# Altium project UHF_Deployment.PrjPcb
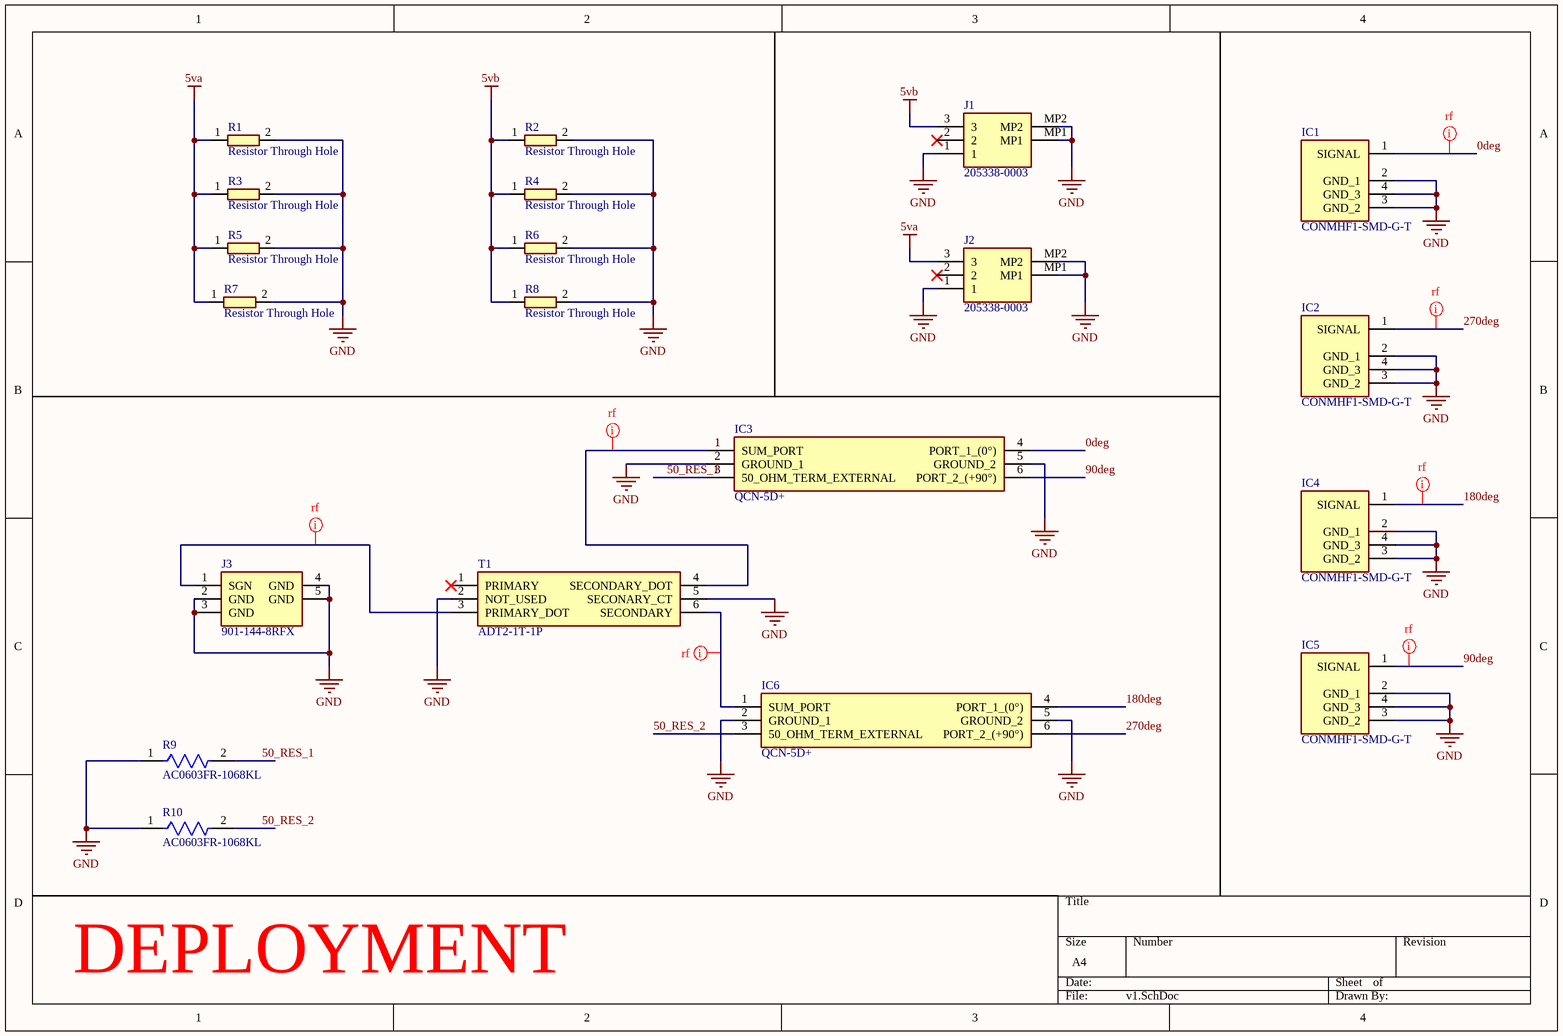
[diagram p0: v1.SchDoc]
1 sheet, 20 parts. Net scope: global (net labels, ports and power ports of the same name join across sheets).
Board file: PCB1.PcbDoc

## Sheet v1.SchDoc
size A4; SheetNumber: 1; SheetTotal: 1

### Parts
IC1  CONMHF1-SMD-G-T  [CONMHF1SMDGT]
IC2  CONMHF1-SMD-G-T  [CONMHF1SMDGT]
IC3  QCN-5D+  [QCN5D]
IC4  CONMHF1-SMD-G-T  [CONMHF1SMDGT]
IC5  CONMHF1-SMD-G-T  [CONMHF1SMDGT]
IC6  QCN-5D+  [QCN5D]
J1  205338-0003  [2053380003]
J2  205338-0003  [2053380003]
J3  901-144-8RFX  [9011448RFX]
R1  Resistor Through Hole  [ResistoR THROUGHHOLE]
R2  Resistor Through Hole  [ResistoR THROUGHHOLE]
R3  Resistor Through Hole  [ResistoR THROUGHHOLE]
R4  Resistor Through Hole  [ResistoR THROUGHHOLE]
R5  Resistor Through Hole  [ResistoR THROUGHHOLE]
R6  Resistor Through Hole  [ResistoR THROUGHHOLE]
R7  Resistor Through Hole  [ResistoR THROUGHHOLE]
R8  Resistor Through Hole  [ResistoR THROUGHHOLE]
R9  AC0603FR-1068KL  [FP-AC0603-IPC_A]
R10  AC0603FR-1068KL  [FP-AC0603-IPC_A]
T1  ADT2-1T-1P  [SOTFL254P691X284-6N]

### Nets
5va: J2.3 R1.1 R3.1 R5.1 R7.1
5vb: J1.3 R2.1 R4.1 R6.1 R8.1
GND: IC1.2(GND_1) IC1.3(GND_2) IC1.4(GND_3) IC2.2(GND_1) IC2.3(GND_2) IC2.4(GND_3) IC3.2(GROUND_1) IC3.5(GROUND_2) IC4.2(GND_1) IC4.3(GND_2) IC4.4(GND_3) IC5.2(GND_1) IC5.3(GND_2) IC5.4(GND_3) IC6.2(GROUND_1) IC6.5(GROUND_2) J1.1 J1.MP1 J1.MP2 J2.1 J2.MP1 J2.MP2 J3.2(GND) J3.3(GND) J3.4(GND) J3.5(GND) R1.2 R2.2 R3.2 R4.2 R5.2 R6.2 R7.2 R8.2 R9.1 R10.1 T1.2(NOT_USED) T1.5(SECONARY_CT)
0deg: IC1.1(SIGNAL) IC3.4(PORT_1_(0°))
50_RES_1: IC3.3(50_OHM_TERM_EXTERNAL) R9.2
50_RES_2: IC6.3(50_OHM_TERM_EXTERNAL) R10.2
90deg: IC3.6(PORT_2_(+90°)) IC5.1(SIGNAL)
180deg: IC4.1(SIGNAL) IC6.4(PORT_1_(0°))
270deg: IC2.1(SIGNAL) IC6.6(PORT_2_(+90°))
NetIC3_1: IC3.1(SUM_PORT) T1.4(SECONDARY_DOT)
NetIC6_1: IC6.1(SUM_PORT) T1.6(SECONDARY)
NetJ3_1: J3.1(SGN) T1.3(PRIMARY_DOT)

Not connected (* = marked no-connect by the designer): J1 2*; J2 2*; T1 1(PRIMARY)*

### Layout directives
mark named rf: 0deg, 90deg, 180deg, 270deg, NetIC3_1, NetIC6_1, NetJ3_1

### Notes on the sheet
- DEPLOYMENT

### Library data of the parts
IC1 IC2 IC4 IC5 = CONMHF1-SMD-G-T: Integrated Circuit; Manufacturer_Name: TE Connectivity; Datasheet Link: https://www.te.com/commerce/DocumentDelivery/DDEController?Action=srchrtrv&DocNm=conmhf1-smd-g-t-ds&DocType=Data%20Sheet&DocLang=English&PartCntxt=CONMHF1-SMD-G-T&DocFormat=pdf; Height: 1.31mm; Manufacturer_Part_Number: CONMHF1-SMD-G-T; Mouser Part Number: 712-CONMHF1-SMD-G-T; Mouser Price/Stock: https://www.mouser.co.uk/ProductDetail/TE-Connectivity-Linx-Technologies/CONMHF1-SMD-G-T?qs=7D1LtPJG0i0JqNJVGTgWfg%3D%3D; Arrow Part Number: CONMHF1-SMD-G-T; Arrow Price/Stock: https://www.arrow.com/en/products/conmhf1-smd-g-t/te-connectivity?utm_currency=USD&region=europe
IC3 IC6 = QCN-5D+: Integrated Circuit; Manufacturer_Name: Mini-Circuits; Datasheet Link: https://www.mouser.in/datasheet/2/1030/QCN-5D_2b-1701289.pdf; Height: 1.068mm; Manufacturer_Part_Number: QCN-5D+; Mouser Part Number: 139-QCN-5D; Mouser Price/Stock: https://www.mouser.co.uk/ProductDetail/Mini-Circuits/QCN-5D%2b?qs=xZ%2FP%252Ba9zWqai7gDmnIyxcA%3D%3D
J1 J2 = 205338-0003: Connector; Manufacturer_Name: Molex; Datasheet Link: https://www.molex.com/pdm_docs/sd/2053380003_sd.pdf; Height: 2.8mm; Manufacturer_Part_Number: 205338-0003; Mouser Part Number: 538-205338-0003; Mouser Price/Stock: https://www.mouser.co.uk/ProductDetail/Molex/205338-0003?qs=GedFDFLaBXFo3ZC3WBiKdg%3D%3D
J3 = 901-144-8RFX: Connector; Manufacturer_Name: Amphenol; Datasheet Link: https://componentsearchengine.com/Datasheets/1/901-144-8RFX.pdf; Height: 9.53mm; Manufacturer_Part_Number: 901-144-8RFX; Mouser Part Number: 523-901-144-8RFX; Mouser Price/Stock: https://www.mouser.co.uk/ProductDetail/Amphenol-RF/901-144-8RFX?qs=jpOL8GWAqat%252BbPjbt8toTg%3D%3D; Arrow Part Number: 901-144-8RFX; Arrow Price/Stock: https://www.arrow.com/en/products/901-144-8rfx/amphenol-rf?region=europe
R1-R8 = Resistor
R9 R10 = CMP-03412-003773-2: RES 68KΩ 1.00% 0.1W 0603; RoHS Compliant: Yes
T1 = ADT2-1T-1P: Transformer; Manufacturer_Name: Mini-Circuits; Datasheet Link: https://www.minicircuits.com/pdfs/ADT2-1T-1P.pdf; Height: 2.84mm; Manufacturer_Part_Number: ADT2-1T-1P